# EAGLE board ams-master-pcb (EAGLE 9.6.2), part 1 of 2
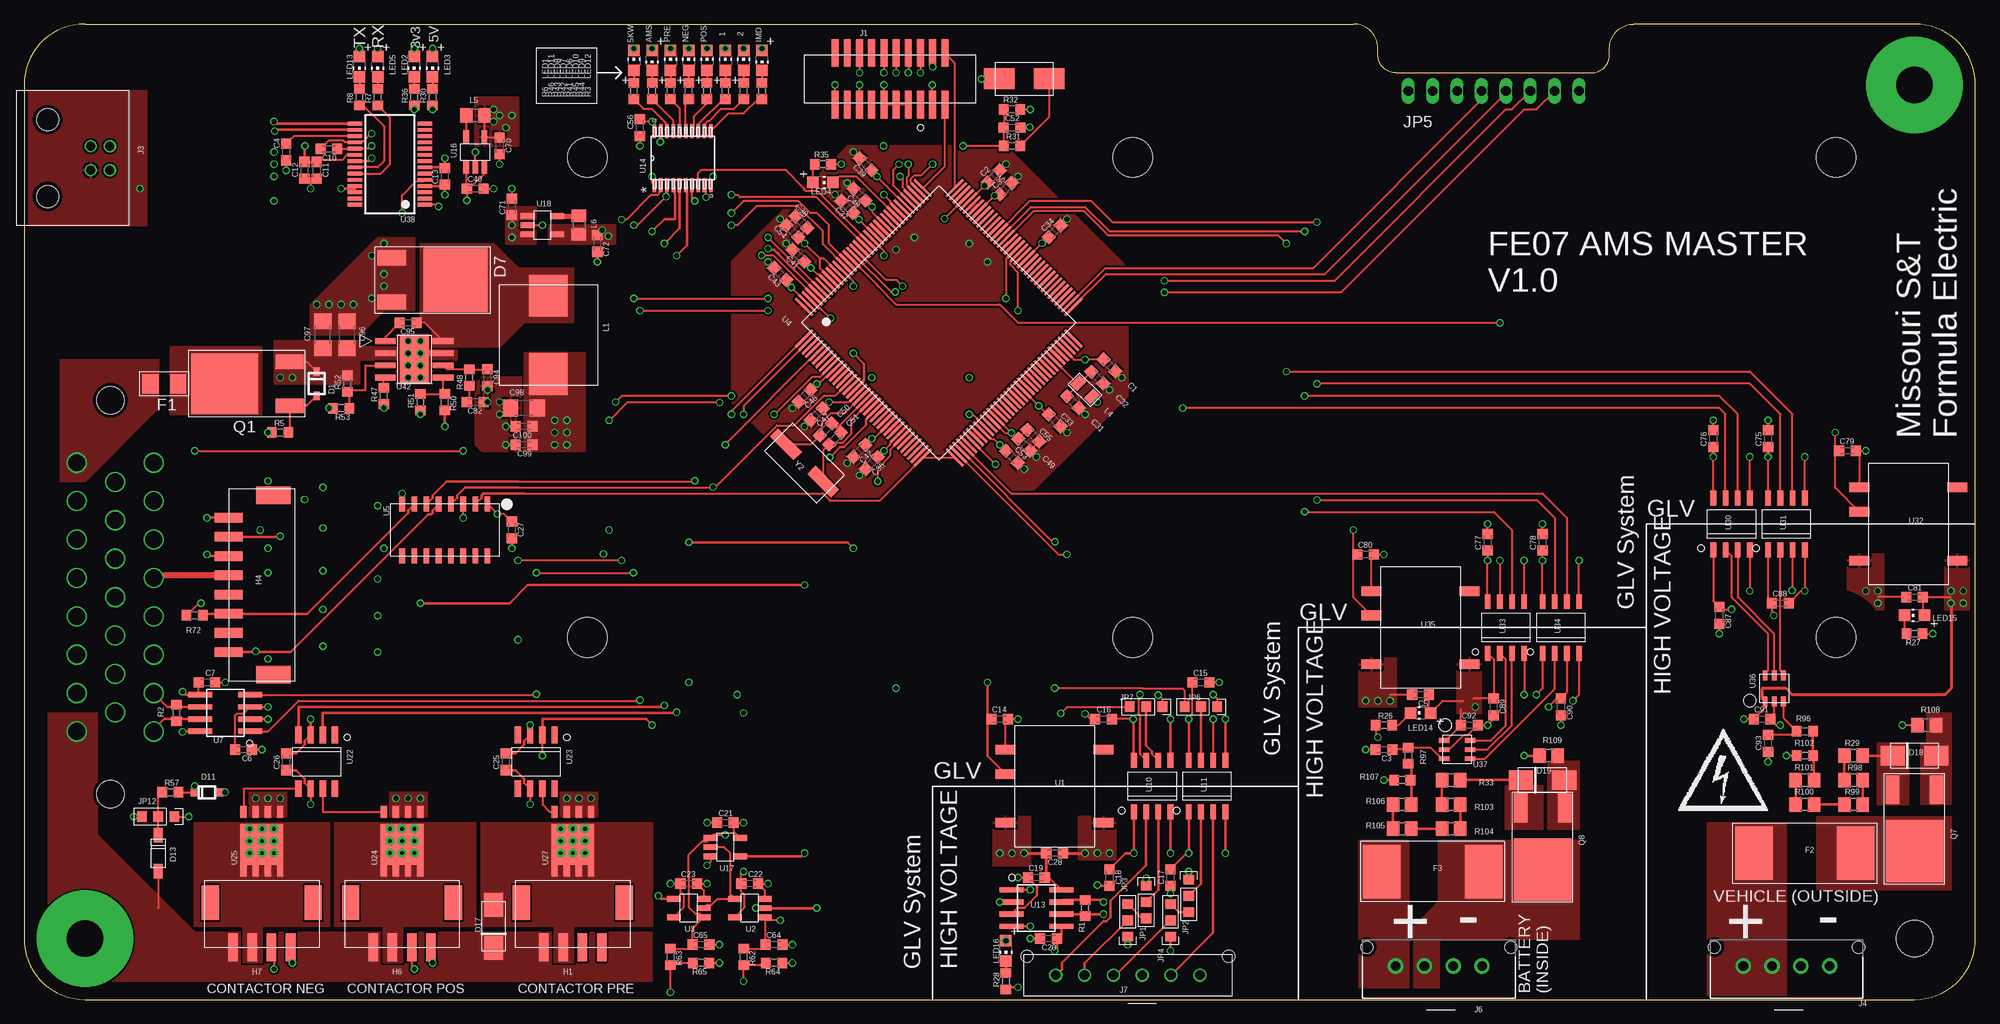
[diagram p7: board, top side]
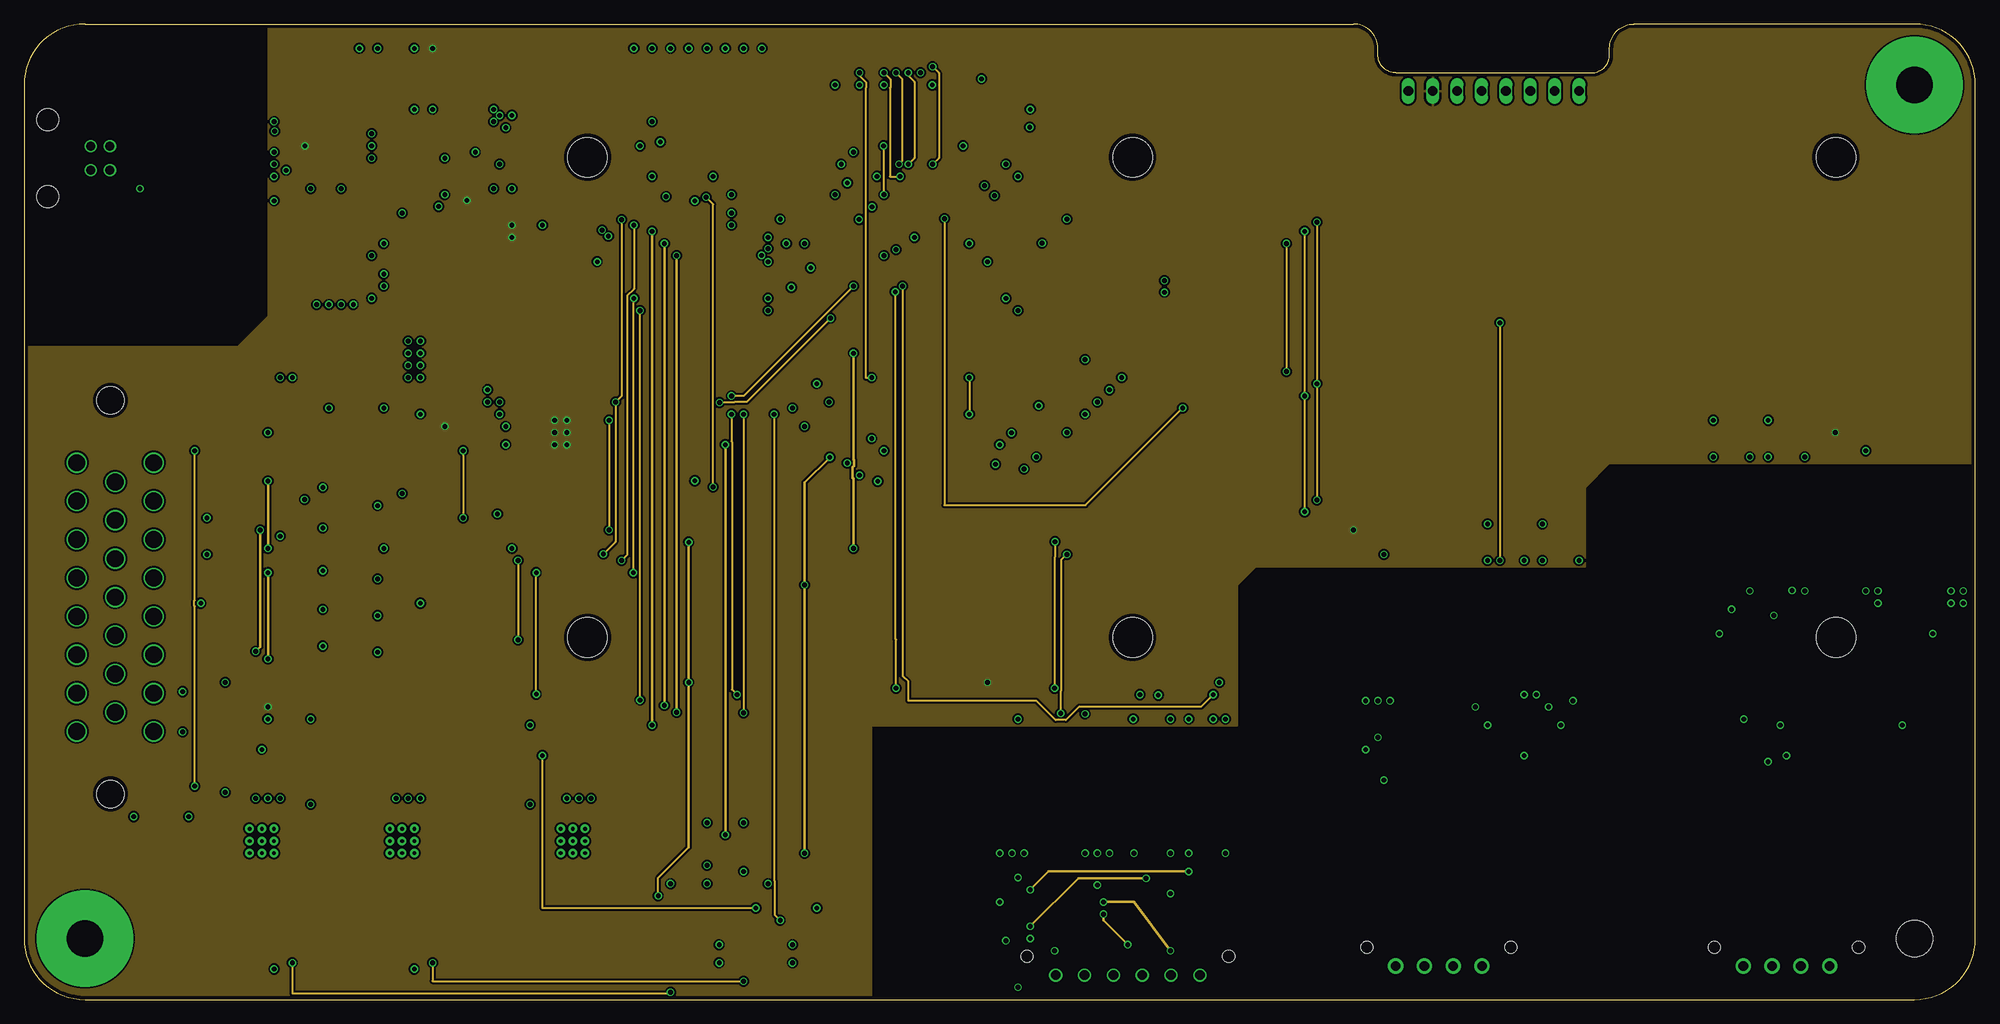
[diagram p8: board, inner layer ROUTE]
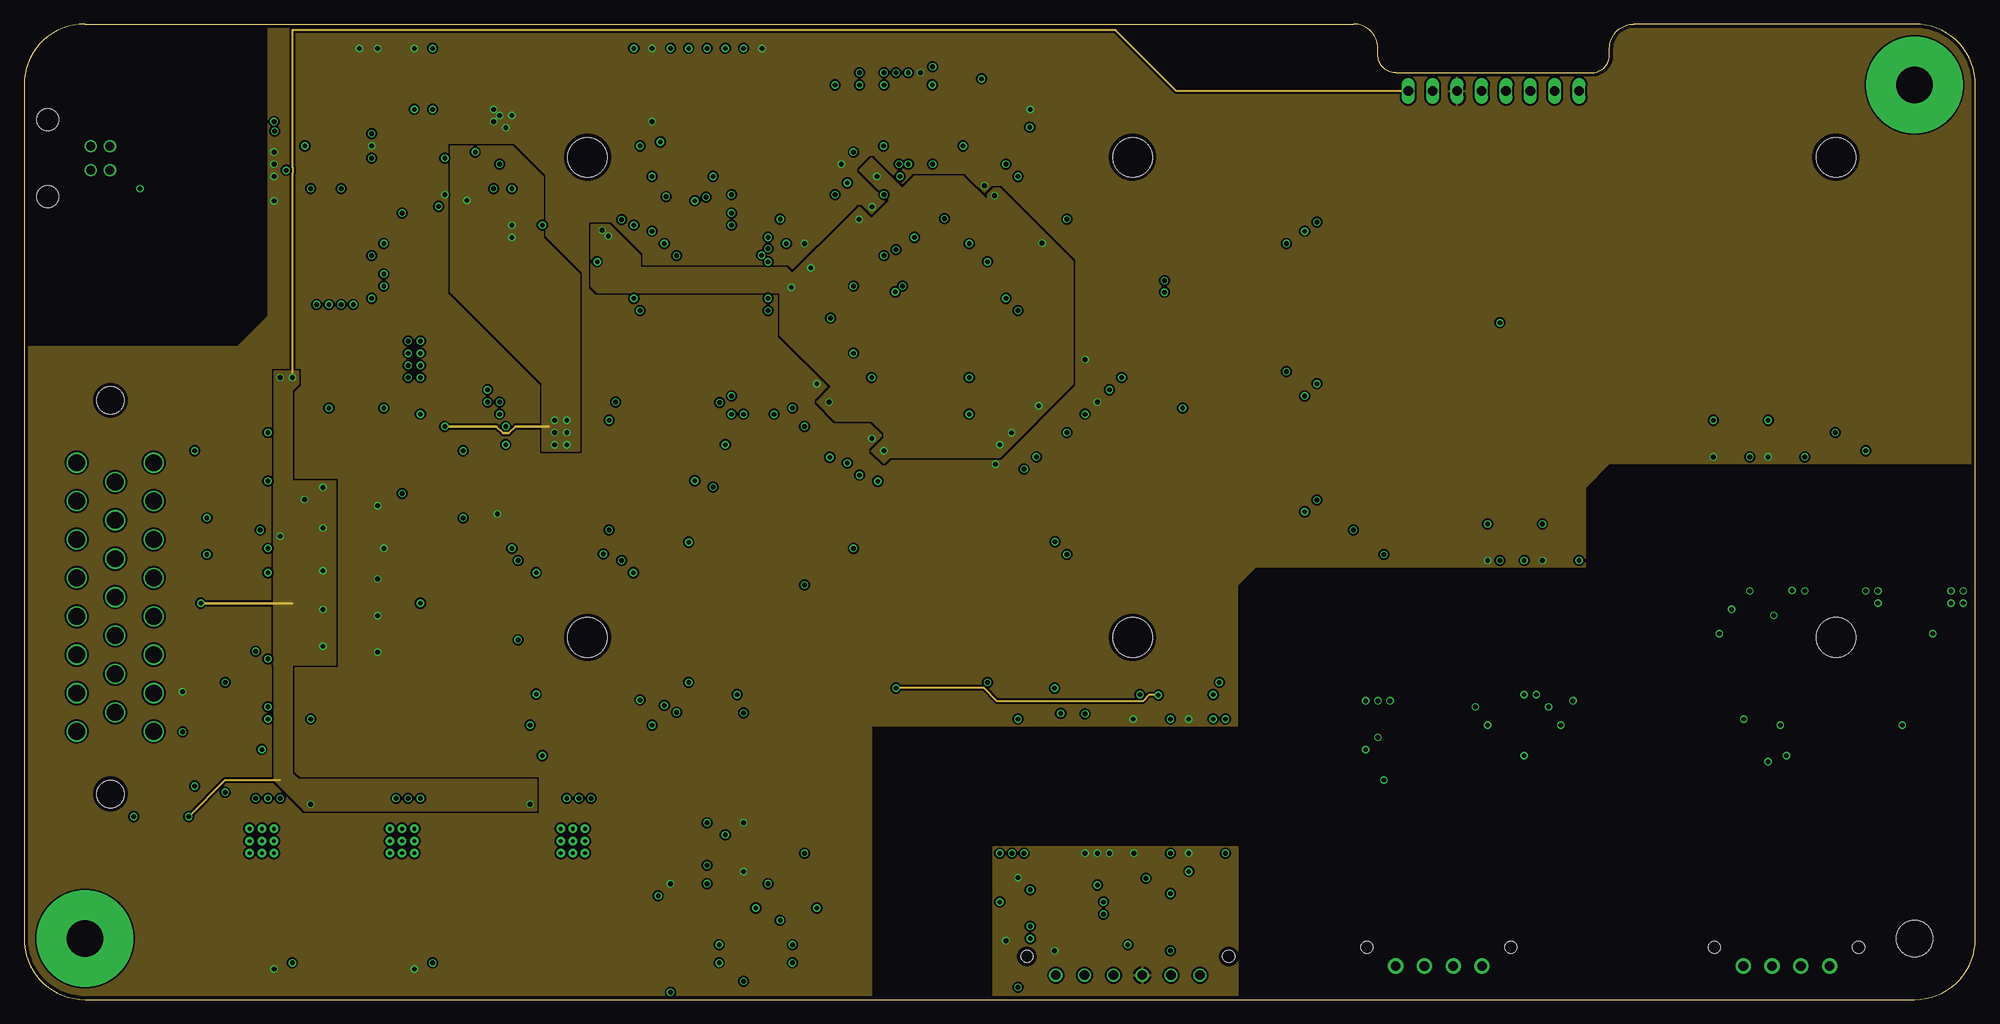
[diagram p9: board, inner layer SUPPLY]
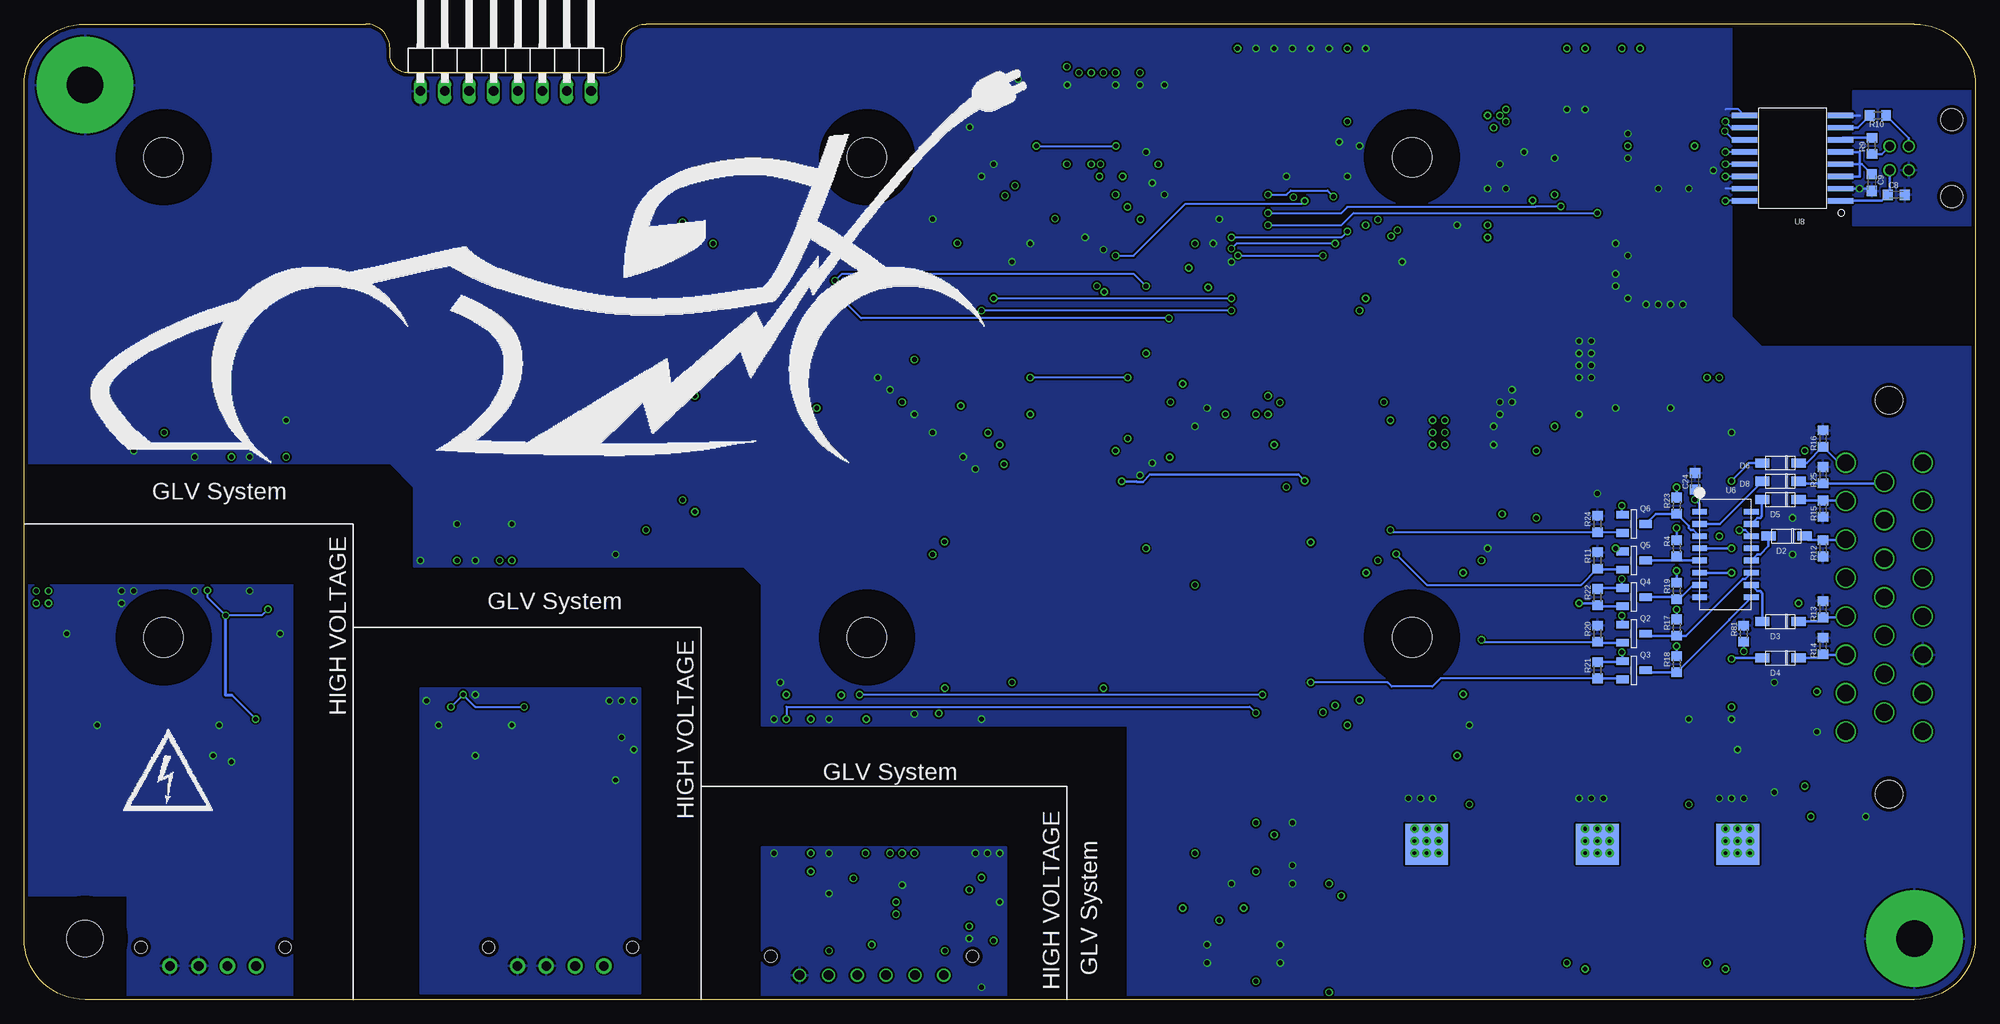
[diagram p10: board, bottom side, seen from below]

Size 203.2 x 101.6 mm. Coordinates in mm from the lower left corner, seen from the top.
Outline: 203.2,6.35 203.2,95.25 arc90 196.85,101.6 167.64,101.6 arc90 165.1,99.06 165.1,98.42 arc-90 163.19,96.52 142.88,96.52 arc-90 140.97,98.42 140.97,99.06 arc90 138.43,101.6 6.35,101.6 arc90 0,95.25 0,6.35 arc90 6.35,0 196.85,0 arc90 203.2,6.35
Copper layers (1*2*15*16): Top 0.035559375mm / dielectric 0.17018125mm / ROUTE 0.01778125mm / dielectric 47mil / SUPPLY 0.01778125mm / dielectric 0.17018125mm / Bottom 0.035559375mm
Design rules "4pcb-4layer *": minimum track width 5mil, minimum drill 10mil, track to track 5mil, track to pad 5mil, pad to pad 5mil, via to via 5mil, smd to smd 5mil, copper to edge 15mil, drill to drill 6mil, minimum pad ring 7mil, minimum via ring 5mil, stop-mask expansion 1.5mil, vias tented up to drill 0mil, thermal gap 10mil
Net classes: 0 default: width 0.203 mm, drill 0.5 mm, clearance 0.203 mm; 1 diffPairs: width 0.254 mm, drill 0.5 mm, clearance 0.254 mm; 3 USB: width 0.254 mm, drill 0.5 mm, clearance 0.254 mm

## Footprints (pad centres in the part's own frame; a part is rotated, then mirrored left to right if it is on the bottom)
C0603K = smd 1.05 x 1.08: 1 -0.875,0; 2 0.875,0
C1206 = smd 1.6 x 1.8: 1 -1.4,0; 2 1.4,0
SOD323F = smd 0.9 x 0.6: ANODE 1.25,0; CATHODE -1.25,0
BAV21W = smd 1.5 x 0.95: ANODE 1.875,0; CATHODE -1.875,0
DPAK = smd 3 x 1.6: 1 4.25,-2.3; 3 4.25,2.3 | smd 6.7 x 6.7: 2 -2.4,0
SOD-323 = smd 0.889 x 0.838: ANODE 1.245,0; CATHODE -1.245,0
ES1D = smd 2.5 x 2: 1 -2.25,0; 2 2.25,0
CMZ59 = smd 2.5 x 2: 1 -2.25,0; 2 2.25,0
FUSE_GENERIC_1206 = smd 1.7 x 2: P$1 -1.45,0; P$2 1.45,0
LITTELFUSE_485 = smd 3.9 x 5.6: P$1 -5.3,0; P$2 5.3,0
MOLEX_5024430470 = smd 1 x 2.9: 1 3,3.45; 2 1,3.45; 3 -1,3.45; 4 -3,3.45 | smd 1.8 x 3.6: P$1 5.35,-1.2; P$2 -5.35,-1.2
MOUNT-HOLE-3.8MM-NPTH = hole 3.8: 0,0
MOLEX_5024430870 = smd 1 x 2.9: 1 7,3.45; 2 5,3.45; 3 3,3.45; 4 1,3.45; 5 -1,3.45; 6 -3,3.45; 7 -5,3.45; 8 -7,3.45 | smd 1.8 x 3.6: P$1 9.35,-1.2; P$2 -9.35,-1.2
SAMTEC-FTR-DUALROW = smd 2.896 x 0.711: 1 -2.705,5.715; 2 2.705,5.715; 3 -2.705,4.445; 4 2.705,4.445; 5 -2.705,3.175; 6 2.705,3.175; 7 -2.705,1.905; 8 2.705,1.905; 9 -2.705,0.635; 10 2.705,0.635; 11 -2.705,-0.635; 12 2.705,-0.635; 13 -2.705,-1.905; 14 2.705,-1.905; 15 -2.705,-3.175; 16 2.705,-3.175; 17 -2.705,-4.445; 18 2.705,-4.445; 19 -2.705,-5.715; 20 2.705,-5.715
TE-776087 = drill 1.75: P$1 -14,13.5; P$2 -10,13.5; P$3 -6,13.5; P$4 -2,13.5; P$5 2,13.5; P$6 6,13.5; P$7 10,13.5; P$8 14,13.5; P$9 -12,9.5; P$10 -8,9.5; P$11 -4,9.5; P$12 0,9.5; P$13 4,9.5; P$14 8,9.5; P$15 12,9.5; P$16 -14,5.5; P$17 -10,5.5; P$18 -6,5.5; P$19 -2,5.5; P$20 2,5.5; P$21 6,5.5; P$22 10,5.5; P$23 14,5.5 | hole 2.85: -20.5,9; 20.5,9
MUSBD111XX = drill 0.92: 1 1.25,9.74; 2 -1.25,9.74; 3 -1.25,7.74; 4 1.25,7.74 | hole 2.3: -4,3.25; 4,3.25
MOLEX_43650-0416_0 = drill 1.016 pad 1.57: 1 4.5,-0.315; 2 1.5,-0.315; 3 -1.5,-0.315; 4 -4.5,-0.315 | hole 1.27: -7.5,-2.275; 7.5,-2.275
MOLEX_43650-0616 = drill 1.016: 1 7.5,0; 2 4.5,0; 3 1.5,0; 4 -1.5,0; 5 -4.5,0; 6 -7.5,0 | hole 1.27: 10.5,-1.96; -10.5,-1.96
0603-TWO-WAY-JUMPER = smd 1 x 1.1: 1 -1.7,0; 2 0,0; 3 1.7,0
1X08/90 = drill 1.016 long: 1 -8.89,-3.81; 2 -6.35,-3.81; 3 -3.81,-3.81; 4 -1.27,-3.81; 5 1.27,-3.81; 6 3.81,-3.81; 7 6.35,-3.81; 8 8.89,-3.81
WURTH-744325XXXX = smd 4.35 x 4: P$1 -4.075,0; P$2 4.075,0
0805 = smd 1 x 1.4: 1 -1,0; 2 1,0
0805' = smd 1.3 x 1.5: 1 -0.95,0; 2 0.95,0
CHIP-LED0805 = smd 1.2 x 1.2: A 0,-1.05; C 0,1.05
MOUNT-HOLE-3.8MM = drill 3.8 pad 10: P$1 0,0
STD45P4LLF6AG = smd 6.3 x 7: D 0,2.6 | smd 1.5 x 2.9: G -2.286,-4.15; S 2.286,-4.15
BSS138 = smd 0.8 x 1.3: D 0,1.2; G -0.95,-1.2; S 0.95,-1.2
FQD3P50 = smd 6 x 6.5: D 0,2.325 | smd 1.4 x 3: G -2.3,-4.075; S 2.3,-4.075
R0603 = smd 1 x 1.1: 1 -0.85,0; 2 0.85,0
R0805 = smd 1.3 x 1.5: 1 -0.95,0; 2 0.95,0
TE-147873-2 = smd 3.2 x 2.2: P$1 -2.6,0; P$2 2.6,0
PDS1-M = smd 1 x 2.1: 1 -3.81,-5.1; 2 -1.27,-5.1; 4 3.81,-5.1; 5 3.81,5.1; 8 -3.81,5.1
SOT23-5 = smd 0.6 x 1.45: 1 -0.95,-1.55; 2 0,-1.55; 4 0.95,1.55; 5 -0.95,1.55 | smd 0.6 x 1.4: 3 0.95,-1.55
LQFP144 = smd 0.27 x 2.5: 1 -8.75,-11.1; 2 -8.25,-11.1; 3 -7.75,-11.1; 4 -7.25,-11.1; 5 -6.75,-11.1; 6 -6.25,-11.1; 7 -5.75,-11.1; 8 -5.25,-11.1; 9 -4.75,-11.1; 10 -4.25,-11.1; 11 -3.75,-11.1; 12 -3.25,-11.1; 13 -2.75,-11.1; 14 -2.25,-11.1; 15 -1.75,-11.1; 16 -1.25,-11.1; 17 -0.75,-11.1; 18 -0.25,-11.1; 19 0.25,-11.1; 20 0.75,-11.1; 21 1.25,-11.1; 22 1.75,-11.1; 23 2.25,-11.1; 24 2.75,-11.1; 25 3.25,-11.1; 26 3.75,-11.1; 27 4.25,-11.1; 28 4.75,-11.1; 29 5.25,-11.1; 30 5.75,-11.1; 31 6.25,-11.1; 32 6.75,-11.1; 33 7.25,-11.1; 34 7.75,-11.1; 35 8.25,-11.1; 36 8.75,-11.1; 73 8.75,11.1; 74 8.25,11.1; 75 7.75,11.1; 76 7.25,11.1; 77 6.75,11.1; 78 6.25,11.1; 79 5.75,11.1; 80 5.25,11.1; 81 4.75,11.1; 82 4.25,11.1; 83 3.75,11.1; 84 3.25,11.1; 85 2.75,11.1; 86 2.25,11.1; 87 1.75,11.1; 88 1.25,11.1; 89 0.75,11.1; 90 0.25,11.1; 91 -0.25,11.1; 92 -0.75,11.1; 93 -1.25,11.1; 94 -1.75,11.1; 95 -2.25,11.1; 96 -2.75,11.1; 97 -3.25,11.1; 98 -3.75,11.1; 99 -4.25,11.1; 100 -4.75,11.1; 101 -5.25,11.1; 102 -5.75,11.1; 103 -6.25,11.1; 104 -6.75,11.1; 105 -7.25,11.1; 106 -7.75,11.1; 107 -8.25,11.1; 108 -8.75,11.1 | smd 2.5 x 0.27: 37 11.1,-8.75; 38 11.1,-8.25; 39 11.1,-7.75; 40 11.1,-7.25; 41 11.1,-6.75; 42 11.1,-6.25; 43 11.1,-5.75; 44 11.1,-5.25; 45 11.1,-4.75; 46 11.1,-4.25; 47 11.1,-3.75; 48 11.1,-3.25; 49 11.1,-2.75; 50 11.1,-2.25; 51 11.1,-1.75; 52 11.1,-1.25; 53 11.1,-0.75; 54 11.1,-0.25; 55 11.1,0.25; 56 11.1,0.75; 57 11.1,1.25; 58 11.1,1.75; 59 11.1,2.25; 60 11.1,2.75; 61 11.1,3.25; 62 11.1,3.75; 63 11.1,4.25; 64 11.1,4.75; 65 11.1,5.25; 66 11.1,5.75; 67 11.1,6.25; 68 11.1,6.75; 69 11.1,7.25; 70 11.1,7.75; 71 11.1,8.25; 72 11.1,8.75; 109 -11.1,8.75; 110 -11.1,8.25; 111 -11.1,7.75; 112 -11.1,7.25; 113 -11.1,6.75; 114 -11.1,6.25; 115 -11.1,5.75; 116 -11.1,5.25; 117 -11.1,4.75; 118 -11.1,4.25; 119 -11.1,3.75; 120 -11.1,3.25; 121 -11.1,2.75; 122 -11.1,2.25; 123 -11.1,1.75; 124 -11.1,1.25; 125 -11.1,0.75; 126 -11.1,0.25; 127 -11.1,-0.25; 128 -11.1,-0.75; 129 -11.1,-1.25; 130 -11.1,-1.75; 131 -11.1,-2.25; 132 -11.1,-2.75; 133 -11.1,-3.25; 134 -11.1,-3.75; 135 -11.1,-4.25; 136 -11.1,-4.75; 137 -11.1,-5.25; 138 -11.1,-5.75; 139 -11.1,-6.25; 140 -11.1,-6.75; 141 -11.1,-7.25; 142 -11.1,-7.75; 143 -11.1,-8.25; 144 -11.1,-8.75
SOIC-16 = smd 0.6 x 1.55: 1 -4.445,-2.7; 2 -3.175,-2.7; 3 -1.905,-2.7; 4 -0.635,-2.7; 5 0.635,-2.7; 6 1.905,-2.7; 7 3.175,-2.7; 8 4.445,-2.7; 9 4.445,2.7; 10 3.175,2.7; 11 1.905,2.7; 12 0.635,2.7; 13 -0.635,2.7; 14 -1.905,2.7; 15 -3.175,2.7; 16 -4.445,2.7
SOIC8-N_MC = smd 2.5 x 0.559: 1 -2.6,1.905; 2 -2.6,0.635; 3 -2.6,-0.635; 4 -2.6,-1.905; 5 2.6,-1.905; 6 2.6,-0.635; 7 2.6,0.635; 8 2.6,1.905
ADUM3160 = smd 0.55 x 2.625: 1 -4.445,-5; 2 -3.175,-5; 3 -1.905,-5; 4 -0.635,-5; 5 0.635,-5; 6 1.905,-5; 7 3.175,-5; 8 4.445,-5; 9 4.445,5; 10 3.175,5; 11 1.905,5; 12 0.635,5; 13 -0.635,5; 14 -1.905,5; 15 -3.175,5; 16 -4.445,5
ISO722X = smd 0.6 x 1.55: P$1 -1.905,-2.7; P$2 -0.635,-2.7; P$3 0.635,-2.7; P$4 1.905,-2.7; P$5 1.905,2.7; P$6 0.635,2.7; P$7 -0.635,2.7; P$8 -1.905,2.7
TSSOP20_MC = smd 1.473 x 0.356: 1 -2.819,2.925; 2 -2.819,2.275; 3 -2.819,1.625; 4 -2.819,0.975; 5 -2.819,0.325; 6 -2.819,-0.325; 7 -2.819,-0.975; 8 -2.819,-1.625; 9 -2.819,-2.275; 10 -2.819,-2.925; 11 2.819,-2.925; 12 2.819,-2.275; 13 2.819,-1.625; 14 2.819,-0.975; 15 2.819,-0.325; 16 2.819,0.325; 17 2.819,0.975; 18 2.819,1.625; 19 2.819,2.275; 20 2.819,2.925
FAN3214 = smd 1.75 x 0.65: 1 -2.8,1.905; 2 -2.8,0.635; 3 -2.8,-0.635; 4 -2.8,-1.905; 5 2.8,-1.905; 6 2.8,-0.635; 7 2.8,0.635; 8 2.8,1.905
SON_5X6 = smd 1.27 x 0.66: 1 3.048,-1.905; 2 3.048,-0.635; 3 3.048,0.635; 4 3.048,1.905; 5 -3.048,1.905; 6 -3.048,0.635; 7 -3.048,-0.635; 8 -3.048,-1.905 | smd 4.267 x 4.47 bottom: PAD -0.33,0 | smd 4.267 x 4.47: PAD1 -0.33,0 | drill 0.381 pad 0.889: VIA1 -1.27,1.27; VIA2 0,1.27; VIA3 1.27,1.27; VIA4 -1.27,0; VIA5 0,0; VIA6 1.27,0; VIA7 -1.27,-1.27; VIA8 0,-1.27; VIA9 1.27,-1.27
ADC121S021 = smd 0.5 x 1.05: P$1 -0.95,-1.35; P$2 0,-1.35; P$3 0.95,-1.35; P$4 0.95,1.35; P$5 0,1.35; P$6 -0.95,1.35
SSOP28 = smd 0.4 x 1.5: 1 -4.225,-3.625; 2 -3.575,-3.625; 3 -2.925,-3.625; 4 -2.275,-3.625; 5 -1.625,-3.625; 6 -0.975,-3.625; 7 -0.325,-3.625; 8 0.325,-3.625; 9 0.975,-3.625; 10 1.625,-3.625; 11 2.275,-3.625; 12 2.925,-3.625; 13 3.575,-3.625; 14 4.225,-3.625; 15 4.225,3.625; 16 3.575,3.625; 17 2.925,3.625; 18 2.275,3.625; 19 1.625,3.625; 20 0.975,3.625; 21 0.325,3.625; 22 -0.325,3.625; 23 -0.975,3.625; 24 -1.625,3.625; 25 -2.275,3.625; 26 -2.925,3.625; 27 -3.575,3.625; 28 -4.225,3.625
TPS54540 = smd 0.6 x 2.15: 1 -1.905,-3; 2 -0.635,-3; 3 0.635,-3; 4 1.905,-3; 5 1.905,3; 6 0.635,3; 7 -0.635,3; 8 -1.905,3 | smd 3.1 x 2.4: PAD 0,0 | smd 4.9 x 2.95: PAD1 0,0
BENDER-ISOMETER = hole 4.128: 5,5; 5,55; 135,5; 135,55; 78.25,5; 78.25,55
CSM-3X = smd 3.5 x 1.2: P$1 2.75,0; P$2 -2.75,0

## Placement (x,y rotation side)
C1  0.1uF  [C0603K]  113.03,66.04 315 top
C2  0.1uF  [C0603K]  100.97,85.72 45 top
C3  DNP  [C0603K]  141.6,26.04 180 top
C4  0.1uF  [C0603K]  27.3,88.27 270 top
C5  4.7uF  [C0603K]  145.41,31.75 180 top
C6  0.1uF  [C0603K]  22.86,26.04 0 top
C7  0.1uF  [C0603K]  19.05,33.02 0 top
C8  0.1uF  [C0603K]  8.26,83.82 0 bottom
C9  0.1uF  [C0603K]  10.79,85.09 270 bottom
C10  0.1uF  [C0603K]  31.75,88.58 180 top
C11  0.1uF  [C0603K]  30.48,86.36 270 top
C12  4.7uF  [C0603K]  29.21,86.36 270 top
C13  0.1uF  [C0603K]  43.81,85.72 90 top
C14  4.7uF  [C0603K]  101.6,29.21 0 top
C15  0.1uF  [C0603K]  122.56,33.02 0 top
C16  0.1uF  [C0603K]  112.39,29.21 180 top
C17  0.1uF  [C0603K]  119.38,12.7 270 top
C18  0.1uF  [C0603K]  113.03,12.7 270 top
C19  0.1uF  [C0603K]  105.41,12.7 0 top
C20  0.1uF  [C0603K]  106.68,6.35 180 top
C21  0.1uF  [C0603K]  73.03,18.41 180 top
C22  0.1uF  [C0603K]  75.56,12.06 0 top
C23  0.1uF  [C0603K]  69.22,12.06 0 top
C24  0.1uF  [C0603K]  29.21,53.98 90 bottom
C25  0.1uF  [C0603K]  50.16,24.77 90 top
C26  0.1uF  [C0603K]  27.3,24.77 90 top
C27  0.1uF  [C0603K]  50.8,48.9 270 top
C28  4.7uF  [C0603K]  107.31,15.24 180 top
C31  4.7uF  [C0603K]  109.22,62.23 315 top
C32  0.1uF  [C0603K]  111.76,64.77 315 top
C33  0.1uF  [C0603K]  107.31,60.33 315 top
C34  0.1uF  [C0603K]  107.31,80.01 45 top
C35  0.1uF  [C0603K]  102.23,84.45 45 top
C36  0.1uF  [C0603K]  88.27,55.88 225 top
C37  0.1uF  [C0603K]  85.72,82.55 135 top
C38  10uF  [C0603K]  80.96,80.96 135 top
C39  0.1uF  [C0603K]  87.63,87 135 top
C40  4.7uF  [C0603K]  46.99,84.45 0 top
C41  0.1uF  [C0603K]  80.64,77.47 135 top
C42  0.1uF  [C0603K]  87,57.15 225 top
C43  0.1uF  [C0603K]  78.74,75.56 135 top
C46  0.1uF  [C0603K]  81.28,62.87 225 top
C47  0.1uF  [C0603K]  82.55,60.96 225 top
C48  0.1uF  [C0603K]  87,83.82 135 top
C49  0.1uF  [C0603K]  104.14,57.78 315 top
C50  22pF  [C0603K]  83.5,59.37 45 top
C51  22pF  [C0603K]  84.45,58.42 45 top
C52  1uF  [C0603K]  102.87,90.81 0 top
C53  0.1uF  [C0603K]  102.87,56.52 315 top
C54  0.1uF  [C0603K]  80.01,80.01 135 top
C55  10uF  [C0603K]  105.09,58.74 315 top
C56  0.1uF  [C0603K]  64.14,90.81 270 top
C64  4.7uF  [C0603K]  78.11,5.71 0 top
C65  4.7uF  [C0603K]  70.48,5.71 0 top
C70  10uF  [C0603K]  49.53,88.9 270 top
C71  4.7uF  [C0603K]  50.8,82.55 90 top
C72  10uF  [C0603K]  59.69,78.74 270 top
C75  0.1uF  [C0603K]  181.61,58.42 90 top
C76  0.1uF  [C0603K]  175.9,58.42 90 top
C77  0.1uF  [C0603K]  152.4,47.62 90 top
C78  0.1uF  [C0603K]  158.12,47.62 90 top
C79  4.7uF  [C0603K]  189.87,57.15 0 top
C80  4.7uF  [C0603K]  139.7,46.35 0 top
C81  4.7uF  [C0603K]  196.85,41.91 180 top
C82  0.012uF  [C0603K]  46.99,62.23 0 top
C87  0.1uF  [C0603K]  176.53,40.01 270 top
C88  0.1uF  [C0603K]  182.88,41.27 0 top
C89  0.1uF  [C0603K]  153.03,30.48 270 top
C90  0.1uF  [C0603K]  160.02,30.48 270 top
C91  0.1uF  [C0603K]  180.97,29.21 0 top
C92  0.1uF  [C0603K]  150.5,28.57 0 top
C93  DNP  [C0603K]  181.61,26.67 270 top
C94  9pF  [C0603K]  48.26,64.77 270 top
C95  0.1uF  [C0603K]  40.01,70.48 0 top
C96  4.7uF 50v  [C1206]  33.66,69.22 90 top
C97  4.7uF 50v  [C1206]  31.11,69.22 90 top
C98  47uF  [C1206]  52.07,61.59 180 top
C99  10uF  [C0603K]  52.07,57.78 180 top
C100  10uF  [C0603K]  52.07,59.69 180 top
D1  MM3Z12VB  [SOD323F]  30.48,64.14 270 top
D2  BAV21W  [BAV21W]  19.68,48.26 180 bottom
D3  BAV21W  [BAV21W]  20.32,39.37 180 bottom
D4  BAV21W  [BAV21W]  20.32,35.56 180 bottom
D5  BAV21W  [BAV21W]  20.32,52.07 180 bottom
D6  BAV21W  [BAV21W]  20.32,55.88 180 bottom
D7  50WQ10FNPBF  [DPAK]  42.55,74.93 180 top
D8  BAV21W  [BAV21W]  20.32,53.98 180 bottom
D11  MM3Z18VT1G  [SOD-323]  19.05,21.59 0 top
D13  BAV21W  [BAV21W]  13.97,15.24 270 top
D17  ES1D  [ES1D]  48.9,7.62 90 top
D18  CMZ5928B  [CMZ59]  196.85,25.4 0 top
D19  CMZ5928B  [CMZ59]  158.12,22.86 0 top
F1  0458005.DR  [FUSE_GENERIC_1206]  14.61,64.14 180 top
F2  0485001.DR  [LITTELFUSE_485]  185.42,15.24 0 top
F3  0485001.DR  [LITTELFUSE_485]  146.69,13.34 0 top
H1  502443-0470  [MOLEX_5024430470]  57.15,8.89 180 top
H2  MOUNT-HOLE-NPTH3.8MM  [MOUNT-HOLE-3.8MM-NPTH]  196.85,6.35 0 top
H4  502443-0870  [MOLEX_5024430870]  24.77,43.18 90 top
H6  502443-0470  [MOLEX_5024430470]  39.37,8.89 180 top
H7  502443-0470  [MOLEX_5024430470]  24.77,8.89 180 top
H16  MUSB2D11004BP  [EMPTY_FOOTPRINT]  49.53,60.33 90 top
J1  M50-3601042  [SAMTEC-FTR-DUALROW]  90.17,95.89 270 top
J2  TE-776087  [TE-776087]  0,41.91 270 top
J3  MUSBD11130  [MUSBD111XX]  -0.8,87.63 270 top
J4  MOLEX_43650-0416MOLEX_43650-0416_0_0  [MOLEX_43650-0416_0]  183.51,3.17 180 top
J6  MOLEX_43650-0416MOLEX_43650-0416_0_0  [MOLEX_43650-0416_0]  147.32,3.17 180 top
J7  43650-0616  [MOLEX_43650-0616]  114.94,2.54 180 top
JP1  0R  [0603-TWO-WAY-JUMPER]  116.84,10.16 90 top
JP2  0R  [0603-TWO-WAY-JUMPER]  121.28,10.79 90 top
JP3  0R  [0603-TWO-WAY-JUMPER]  114.94,8.26 270 top
JP4  0R  [0603-TWO-WAY-JUMPER]  119.38,8.26 270 top
JP5  [1X08/90]  153.03,98.42 0 bottom
JP6  0R  [0603-TWO-WAY-JUMPER]  122.56,30.48 0 top
JP7  0R  [0603-TWO-WAY-JUMPER]  116.84,30.48 0 top
JP12  10k  [0603-TWO-WAY-JUMPER]  13.97,19.05 0 top
L1  10uH  [WURTH-744325XXXX]  54.61,69.22 270 top
L4  220R @ 100M  [0805]  110.49,63.5 135 top
L5  2.2uH  [0805']  46.99,92.08 0 top
L6  2.2uH  [0805']  57.78,80.64 270 top
LED1  BLUE  [CHIP-LED0805]  63.5,97.79 0 top
LED2  GREEN  [CHIP-LED0805]  40.64,97.16 180 top
LED3  GREEN  [CHIP-LED0805]  42.55,97.16 180 top
LED4  RED  [CHIP-LED0805]  83.19,85.09 270 top
LED5  ORANGE  [CHIP-LED0805]  36.83,97.16 180 top
LED6  GREEN  [CHIP-LED0805]  71.12,97.79 0 top
LED7  GREEN  [CHIP-LED0805]  69.22,97.79 0 top
LED8  GREEN  [CHIP-LED0805]  67.31,97.79 0 top
LED9  GREEN  [CHIP-LED0805]  74.93,97.79 0 top
LED10  ORANGE  [CHIP-LED0805]  73.03,97.79 0 top
LED11  RED  [CHIP-LED0805]  65.41,97.79 180 top
LED12  RED  [CHIP-LED0805]  76.83,97.79 180 top
LED13  ORANGE  [CHIP-LED0805]  34.92,97.16 180 top
LED14  GREEN  [CHIP-LED0805]  145.41,29.84 90 top
LED15  GREEN  [CHIP-LED0805]  196.85,40.01 90 top
LED16  GREEN  [CHIP-LED0805]  102.23,5.08 180 top
MP1  MOUNT-HOLE3.8MM  [MOUNT-HOLE-3.8MM]  6.35,6.35 0 top
MP2  MOUNT-HOLE3.8MM  [MOUNT-HOLE-3.8MM]  196.85,95.25 0 top
Q1  STD45P4LLF6AG  [STD45P4LLF6AG]  23.5,64.14 90 top
Q2  BSS138  [BSS138]  35.56,38.1 270 bottom
Q3  BSS138  [BSS138]  35.56,34.29 270 bottom
Q4  BSS138  [BSS138]  35.56,41.91 270 bottom
Q5  BSS138  [BSS138]  35.56,45.72 270 bottom
Q6  BSS138  [BSS138]  35.56,49.53 270 bottom
Q7  FQD3P50  [FQD3P50]  196.85,17.78 180 top
Q8  FQD3P50  [FQD3P50]  158.12,15.88 180 top
R1  120  [R0603]  110.49,9.53 90 top
R2  120  [R0603]  15.88,29.84 270 top
R3  1k  [R0603]  76.83,94.61 270 top
R4  10k  [R0603]  31.11,46.99 270 bottom
R5  1.5k  [R0603]  26.67,59.05 0 top
R6  1k  [R0603]  63.5,94.61 90 top
R7  270  [R0603]  36.83,93.98 90 top
R8  270  [R0603]  34.92,93.98 90 top
R9  24R  [R0603]  10.79,88.9 90 bottom
R10  24R  [R0603]  10.16,92.08 180 bottom
R11  10k  [R0603]  39.37,45.72 90 bottom
R12  DNP/10k  [R0603]  15.88,46.99 90 bottom
R13  DNP/10k  [R0603]  15.88,40.64 270 bottom
R14  DNP/10k  [R0603]  15.88,36.83 270 bottom
R15  DNP/10k  [R0603]  15.88,51.12 90 bottom
R16  DNP/10k  [R0603]  15.88,58.42 270 bottom
R17  100k  [R0603]  31.11,38.73 270 bottom
R18  10k  [R0603]  31.11,34.92 270 bottom
R19  10k  [R0603]  31.11,42.55 270 bottom
R20  10k  [R0603]  39.37,38.1 270 bottom
R21  10k  [R0603]  39.37,34.29 270 bottom
R22  10k  [R0603]  39.37,41.91 270 bottom
R23  10k  [R0603]  31.11,51.44 270 bottom
R24  10k  [R0603]  39.37,49.53 90 bottom
R25  DNP/10k  [R0603]  15.88,54.61 270 bottom
R26  1k  [R0603]  141.6,28.57 0 top
R27  1k  [R0603]  196.85,38.1 180 top
R28  1k  [R0603]  102.23,1.91 90 top
R29  150k  [R0805]  190.5,25.4 180 top
R30  1k  [R0603]  42.55,93.98 90 top
R31  100  [R0603]  102.87,88.9 0 top
R32  2.2K  [R0603]  102.87,92.71 180 top
R33  150k  [R0805]  148.59,22.86 180 top
R35  2.2K  [R0603]  83.19,87 180 top
R36  1k  [R0603]  40.64,93.98 90 top
R41  1k  [R0603]  71.12,94.61 90 top
R42  1k  [R0603]  69.22,94.61 90 top
R43  1k  [R0603]  67.31,94.61 90 top
R44  1k  [R0603]  74.93,94.61 90 top
R45  1k  [R0603]  73.03,94.61 90 top
R46  1k  [R0603]  65.41,94.61 270 top
R47  162k  [R0603]  37.47,62.87 90 top
R48  15k  [R0603]  46.35,64.77 90 top
R50  60.4k  [R0603]  43.81,62.23 270 top
R51  11.5k  [R0603]  41.27,62.23 90 top
R52  DNP  [R0603]  33.66,64.14 90 top
R53  DNP  [R0603]  33.02,61.59 0 top
R57  1.5k  [R0603]  15.24,21.59 0 top
R62  20k  [R0603]  74.93,4.45 270 top
R63  20k  [R0603]  67.31,4.45 270 top
R64  10k  [R0603]  78.11,3.81 180 top
R65  10k  [R0603]  70.48,3.81 180 top
R72  2.2k  [R0603]  17.78,40.01 0 top
R81  2.2k  [R0603]  24.13,38.1 90 bottom
R96  0R  [R0603]  185.42,27.94 180 top
R97  0R  [R0603]  144.15,25.4 90 top
R98  150k  [R0805]  190.5,22.86 0 top
R99  150k  [R0805]  190.5,20.32 180 top
R100  150k  [R0805]  185.42,20.32 180 top
R101  150k  [R0805]  185.42,22.86 0 top
R102  10k  [R0603]  185.42,25.4 180 top
R103  150k  [R0805]  148.59,20.32 0 top
R104  150k  [R0805]  148.59,17.78 180 top
R105  150k  [R0805]  143.51,17.78 180 top
R106  150k  [R0805]  143.51,20.32 0 top
R107  10k  [R0603]  143.51,22.86 180 top
R108  1M  [R0805]  198.12,28.57 0 top
R109  1M  [R0805]  158.75,25.4 0 top
S2  147873-2  [TE-147873-2]  104.14,95.89 180 top
U1  PDS1-S5-S5-M-TR  [PDS1-M]  107.31,22.23 270 top
U2  SN74LVC1G32DBV  [SOT23-5]  75.56,9.53 90 top
U3  SN74LVC1G08DBV  [SOT23-5]  69.22,9.53 90 top
U4  [LQFP144]  95.25,70.48 315 top
U5  CD4050BD  [SOIC-16]  43.81,48.9 180 top
U6  CD4050BD  [SOIC-16]  26.04,46.35 270 bottom
U7  MCP2562FD  [SOIC8-N_MC]  20.95,29.84 180 top
U8  ADUM3160BRWZ-RL  [ADUM3160]  19.05,87.63 90 bottom
U10  ISO7221  [ISO722X]  117.47,22.23 0 top
U11  ISO7221  [ISO722X]  123.19,22.23 0 top
U13  MCP2562FD  [SOIC8-N_MC]  105.41,9.53 0 top
U14  SN74LVC541A  [TSSOP20_MC]  68.58,87.63 90 top
U16  LM3671MF-3.3/NOPB  [SOT23-5]  46.99,88.27 0 top
U17  SN74LVC1G02DBV  [SOT23-5]  73.03,15.88 270 top
U18  LM3671MF-1.2/NOPB  [SOT23-5]  53.98,80.64 270 top
U22  FAN3214  [FAN3214]  30.48,24.77 270 top
U23  FAN3214  [FAN3214]  53.34,24.77 270 top
U24  CSD17506Q5A  [SON_5X6]  39.37,16.51 90 top
U25  CSD17506Q5A  [SON_5X6]  24.77,16.51 90 top
U27  CSD17506Q5A  [SON_5X6]  57.15,16.51 90 top
U30  ISO7221  [ISO722X]  177.8,49.53 0 top
U31  ISO7221  [ISO722X]  183.51,49.53 0 top
U32  PDS1-S5-S5-M-TR  [PDS1-M]  196.22,49.53 270 top
U33  ISO7221  [ISO722X]  154.31,38.73 0 top
U34  ISO7221  [ISO722X]  160.02,38.73 0 top
U35  PDS1-S5-S5-M-TR  [PDS1-M]  145.41,38.73 270 top
U36  ADC121S021  [ADC121S021]  182.25,32.38 0 top
U37  ADC121S021  [ADC121S021]  149.22,26.04 270 top
U38  FT232RL  [SSOP28]  38.1,87 90 top
U42  TPS54540DDARQ1  [TPS54540]  40.64,66.67 270 top
U$1  [BENDER-ISOMETER]  193.68,92.71 180 top
Y2  16MHz  [CSM-3X]  81.28,55.88 135 top